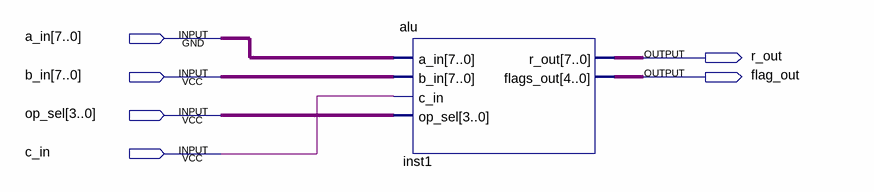
[diagram p0: schematic sheet]
// Quartus schematic ulaBloco.bdf as structural Verilog: 1 symbols, 6 pins
module ulaBloco (
  input  [7:0] a_in,
  input  [7:0] b_in,
  input  [3:0] op_sel,
  input  c_in,
  output r_out,
  output flag_out
);

  wire [4:0] inst1_flags_out;
  wire [7:0] inst1_r_out;

  alu inst1 (.a_in(a_in), .b_in(b_in), .c_in(c_in), .op_sel(op_sel), .r_out(inst1_r_out), .flags_out(inst1_flags_out));
endmodule
